# Altium schematic sheet shower.SchDoc
size A4
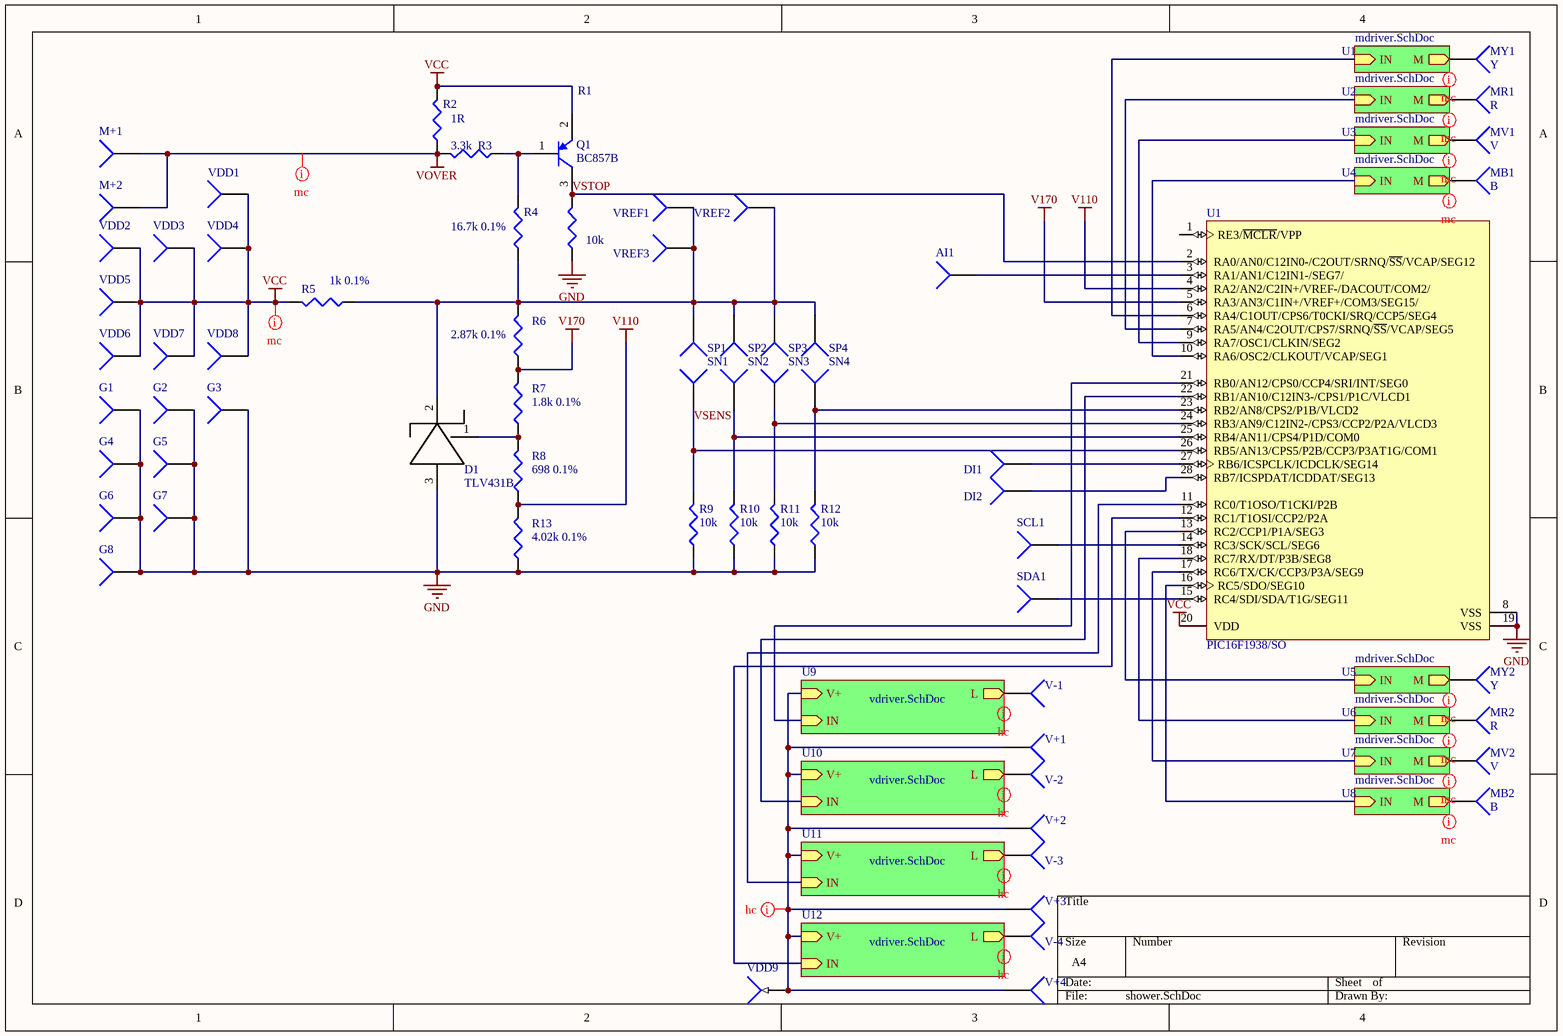
[diagram p0: shower.SchDoc]

## Parts
AI1  +5V  [PIN1]  (value not drawn)
D1  TLV431B  [SOT-23_N]
DI1  +5V  [PIN1]  (value not drawn)
DI2  +5V  [PIN1]  (value not drawn)
G1  Socket  [PIN1]  (value not drawn)
G2  Socket  [PIN1]  (value not drawn)
G3  Socket  [PIN1]  (value not drawn)
G4  Socket  [PIN1]  (value not drawn)
G5  Socket  [PIN1]  (value not drawn)
G6  Socket  [PIN1]  (value not drawn)
G7  Socket  [PIN1]  (value not drawn)
G8  Socket  [PIN1]  (value not drawn)
M+1  +5V  [PIN1]  (value not drawn)
M+2  +5V  [PIN1]  (value not drawn)
MB1  B  [PIN1]
MB2  B  [PIN1]
MR1  R  [PIN1]
MR2  R  [PIN1]
MV1  V  [PIN1]
MV2  V  [PIN1]
MY1  Y  [PIN1]
MY2  Y  [PIN1]
Q1  BC857B  [SOT-23_N]
R1  10k  [J1-0603]
R2  1R  [J1-0603]
R3  3.3k  [J1-0603]
R4  16.7k 0.1%  [J1-0603]
R5  1k 0.1%  [J1-0603]
R6  2.87k 0.1%  [J1-0603]
R7  1.8k 0.1%  [J1-0603]
R8  698 0.1%  [J1-0603]
R9  10k  [J1-0603]
R10  10k  [J1-0603]
R11  10k  [J1-0603]
R12  10k  [J1-0603]
R13  4.02k 0.1%  [J1-0603]
SCL1  +5V  [PIN1]  (value not drawn)
SDA1  +5V  [PIN1]  (value not drawn)
SN1  +5V  [PIN1]  (value not drawn)
SN2  +5V  [PIN1]  (value not drawn)
SN3  +5V  [PIN1]  (value not drawn)
SN4  +5V  [PIN1]  (value not drawn)
SP1  +5V  [PIN1]  (value not drawn)
SP2  +5V  [PIN1]  (value not drawn)
SP3  +5V  [PIN1]  (value not drawn)
SP4  +5V  [PIN1]  (value not drawn)
U1  PIC16F1938/SO  [SOIC-SO28_N]
V+1  +5V  [PIN1]  (value not drawn)
V+2  +5V  [PIN1]  (value not drawn)
V+3  +5V  [PIN1]  (value not drawn)
V+4  +5V  [PIN1]  (value not drawn)
V-1  +5V  [PIN1]  (value not drawn)
V-2  +5V  [PIN1]  (value not drawn)
V-3  +5V  [PIN1]  (value not drawn)
V-4  +5V  [PIN1]  (value not drawn)
VDD1  +5V  [PIN1]  (value not drawn)
VDD2  +5V  [PIN1]  (value not drawn)
VDD3  +5V  [PIN1]  (value not drawn)
VDD4  +5V  [PIN1]  (value not drawn)
VDD5  +5V  [PIN1]  (value not drawn)
VDD6  +5V  [PIN1]  (value not drawn)
VDD7  +5V  [PIN1]  (value not drawn)
VDD8  +5V  [PIN1]  (value not drawn)
VDD9  +5V  [PIN1]  (value not drawn)
VREF1  +5V  [PIN1]  (value not drawn)
VREF2  +5V  [PIN1]  (value not drawn)
VREF3  +5V  [PIN1]  (value not drawn)

## Sub-sheets
U1 = mdriver.SchDoc: IN (in), M (out)
U2 = mdriver.SchDoc: IN (in), M (out)
U3 = mdriver.SchDoc: IN (in), M (out)
U4 = mdriver.SchDoc: IN (in), M (out)
U5 = mdriver.SchDoc: IN (in), M (out)
U6 = mdriver.SchDoc: IN (in), M (out)
U7 = mdriver.SchDoc: IN (in), M (out)
U8 = mdriver.SchDoc: IN (in), M (out)
U9 = vdriver.SchDoc: IN (in), V+ (in), L (out)
U10 = vdriver.SchDoc: IN (in), V+ (in), L (out)
U11 = vdriver.SchDoc: IN (in), V+ (in), L (out)
U12 = vdriver.SchDoc: IN (in), V+ (in), L (out)

## Nets
GND: D1.3 G1.1 G2.1 G3.1 G4.1 G5.1 G6.1 G7.1 G8.1 R1.1 R9.1 R10.1 R11.1 R12.1 R13.1 U1.8(VSS) U1.19(VSS)
V110: R8.1 R13.2 U1.4(RA2/AN2/C2IN+/VREF-/DACOUT/COM2/)
V170: R6.1 R7.2 U1.5(RA3/AN3/C1IN+/VREF+/COM3/SEG15/)
VCC: Q1.2(E) R2.2 R5.2 U1.20(VDD) VDD1.1 VDD2.1 VDD3.1 VDD4.1 VDD5.1 VDD6.1 VDD7.1 VDD8.1
VOVER: M+1.1 M+2.1 R2.1 R3.2
VSENS: R9.2 SN1.1 U1.26(RB5/AN13/CPS5/P2B/CCP3/P3AT1G/COM1)
VSTOP: Q1.3(C) R1.2 U1.2(RA0/AN0/C12IN0-/C2OUT/SRNQ/~{SS}/VCAP/SEG12)
NetAI1_1: AI1.1 U1.3(RA1/AN1/C12IN1-/SEG7/)
NetD1_1: D1.1 R7.1 R8.2
NetD1_2: D1.2 R4.1 R5.1 R6.2 SP1.1 SP2.1 SP3.1 SP4.1 VREF1.1 VREF2.1 VREF3.1
NetDI1_1: DI1.1 U1.27(RB6/ICSPCLK/ICDCLK/SEG14)
NetDI2_1: DI2.1 U1.28(RB7/ICSPDAT/ICDDAT/SEG13)
NetMB1_1: MB1.1 ; sheet U4/M
NetMB2_1: MB2.1 ; sheet U8/M
NetMR1_1: MR1.1 ; sheet U2/M
NetMR2_1: MR2.1 ; sheet U6/M
NetMV1_1: MV1.1 ; sheet U3/M
NetMV2_1: MV2.1 ; sheet U7/M
NetMY1_1: MY1.1 ; sheet U1/M
NetMY2_1: MY2.1 ; sheet U5/M
NetQ1_1: Q1.1(B) R3.1 R4.2
NetR10_2: R10.2 SN2.1 U1.25(RB4/AN11/CPS4/P1D/COM0)
NetR11_2: R11.2 SN3.1 U1.24(RB3/AN9/C12IN2-/CPS3/CCP2/P2A/VLCD3)
NetR12_2: R12.2 SN4.1 U1.23(RB2/AN8/CPS2/P1B/VLCD2)
NetSCL1_1: SCL1.1 U1.14(RC3/SCK/SCL/SEG6)
NetSDA1_1: SDA1.1 U1.15(RC4/SDI/SDA/T1G/SEG11)
NetU1_6: U1.6(RA4/C1OUT/CPS6/T0CKI/SRQ/CCP5/SEG4) ; sheet U1/IN
NetU1_7: U1.7(RA5/AN4/C2OUT/CPS7/SRNQ/~{SS}/VCAP/SEG5) ; sheet U2/IN
NetU1_9: U1.9(RA7/OSC1/CLKIN/SEG2) ; sheet U3/IN
NetU1_10: U1.10(RA6/OSC2/CLKOUT/VCAP/SEG1) ; sheet U4/IN
NetU1_11: U1.11(RC0/T1OSO/T1CKI/P2B) ; sheet U11/IN
NetU1_12: U1.12(RC1/T1OSI/CCP2/P2A) ; sheet U12/IN
NetU1_13: U1.13(RC2/CCP1/P1A/SEG3) ; sheet U5/IN
NetU1_16: U1.16(RC5/SDO/SEG10) ; sheet U8/IN
NetU1_17: U1.17(RC6/TX/CK/CCP3/P3A/SEG9) ; sheet U7/IN
NetU1_18: U1.18(RC7/RX/DT/P3B/SEG8) ; sheet U6/IN
NetU1_21: U1.21(RB0/AN12/CPS0/CCP4/SRI/INT/SEG0) ; sheet U9/IN
NetU1_22: U1.22(RB1/AN10/C12IN3-/CPS1/P1C/VLCD1) ; sheet U10/IN
NetV+1_1: V+1.1 V+2.1 V+3.1 V+4.1 VDD9.1 ; sheet U10/V+, sheet U11/V+, sheet U12/V+, sheet U9/V+
NetV-1_1: V-1.1 ; sheet U9/L
NetV-2_1: V-2.1 ; sheet U10/L
NetV-3_1: V-3.1 ; sheet U11/L
NetV-4_1: V-4.1 ; sheet U12/L

Not connected (* = marked no-connect by the designer): U1 1(RE3/~{MCLR}/VPP)

## Layout directives
net class hc: NetV+1_1, NetV-1_1, NetV-2_1, NetV-3_1, NetV-4_1
net class mc: NetMB1_1, NetMB2_1, NetMR1_1, NetMR2_1, NetMV1_1, NetMV2_1, NetMY1_1, NetMY2_1, VCC, VOVER

## Library data of the parts
AI1 DI1 DI2 M+1 M+2 MB1 MB2 MR1 MR2 MV1 MV2 MY1 MY2 SCL1 SDA1 SN1-SN4 SP1-SP4 V+1-V+4 V-1-V-4 VDD1-VDD9 VREF1-VREF3 = Socket: LatestRevisionDate: 17-Jul-2002; LatestRevisionNote: Re-released for DXP Platform.; Publisher: Altium Limited
D1 = TLV431A
Q1 = PNP: PNP Bipolar Transistor; Published: 8-Jun-2000; LatestRevisionDate: 29-May-2009; LatestRevisionNote: IPC-7351 Footprint Added.; PackageVersion: Aug-1999; PackageReference: SOT-23B; Publisher: Altium Limited; PackageDescription: 3-Pin SOT-23 Package 0.95 mm Pitch, 2.4 mm Lead Span
R1 R3-R7 R9-R13 = Res3: Resistor; Published: 8-Jun-2000; LatestRevisionDate: 29-May-2009; LatestRevisionNote: IPC-7351 Footprint Added.; PackageReference: J1-0603; Publisher: Altium Limited; PackageDescription: Chip Resistor
  R1 R9-R12: Value: 10K
  R3: Value: 3.3K
  R4: Value: 16.7k
  R5: Value: 1k
  R6: Value: 2.87K
  R7: Value: 1.8k
  R13: Value: 4.02K
R2 = Res3: Resistor; Value: 1; Published: 8-Jun-2000; LatestRevisionDate: 29-May-2009; LatestRevisionNote: IPC-7351 Footprint Added.; PackageReference: J1-0603; Publisher: Altium Limited; PackageDescription: Chip Resistor
R8 = Res3: Resistor; Value: 698; Published: 8-Jun-2000; LatestRevisionDate: 29-May-2009; LatestRevisionNote: IPC-7351 Footprint Added.; PackageReference: J1-0603; Publisher: Altium Limited; PackageDescription: Chip Resistor
U1 = PIC16F1936T-I/SO: CMOS Microcontroller with LCD Driver, 8K (words) Program Memory, 256 Bytes Data Memory, 512 Bytes SRAM, 25 I/O's, 28-Pin SOIC, Industrial Temperature, Tape and Reel; Published: 40149; LatestRevisionDate: 11-Aug-2010; LatestRevisionNote: Sch. layout revised.; DatasheetVersion: revC, Sep-2009; PackageVersion: revBB, Aug-2009; PackageReference: SOIC-SO28; Publisher: Altium Limited; PackageDescription: 28-Lead Plastic Small Outline (SO) - Wide 7.50mm Body [SOIC]; Supplier 1: Digi-Key; Supplier Part Number 1: PIC16F1936T-I/SO-ND; Code_JEDEC: MS-013; ComponentLink1Description: Datasheet; ComponentLink1URL: http://ww1.microchip.com/downloads/en/DeviceDoc/41364C.pdf; ComponentLink2Description: Packaging Specification; ComponentLink2URL: http://www.microchip.com/stellent/groups/techpub_sg/documents/packagingspec/en012702.pdf; ComponentLink3Description: Microchip.com Home; ComponentLink3URL: http://www.microchip.com/
G1-G8 = Socket: LatestRevisionDate: 17-Jul-2002; LatestRevisionNote: Re-released for DXP Platform.; Publisher: Altium Limited